# EAGLE design main (EAGLE 9.5.2)
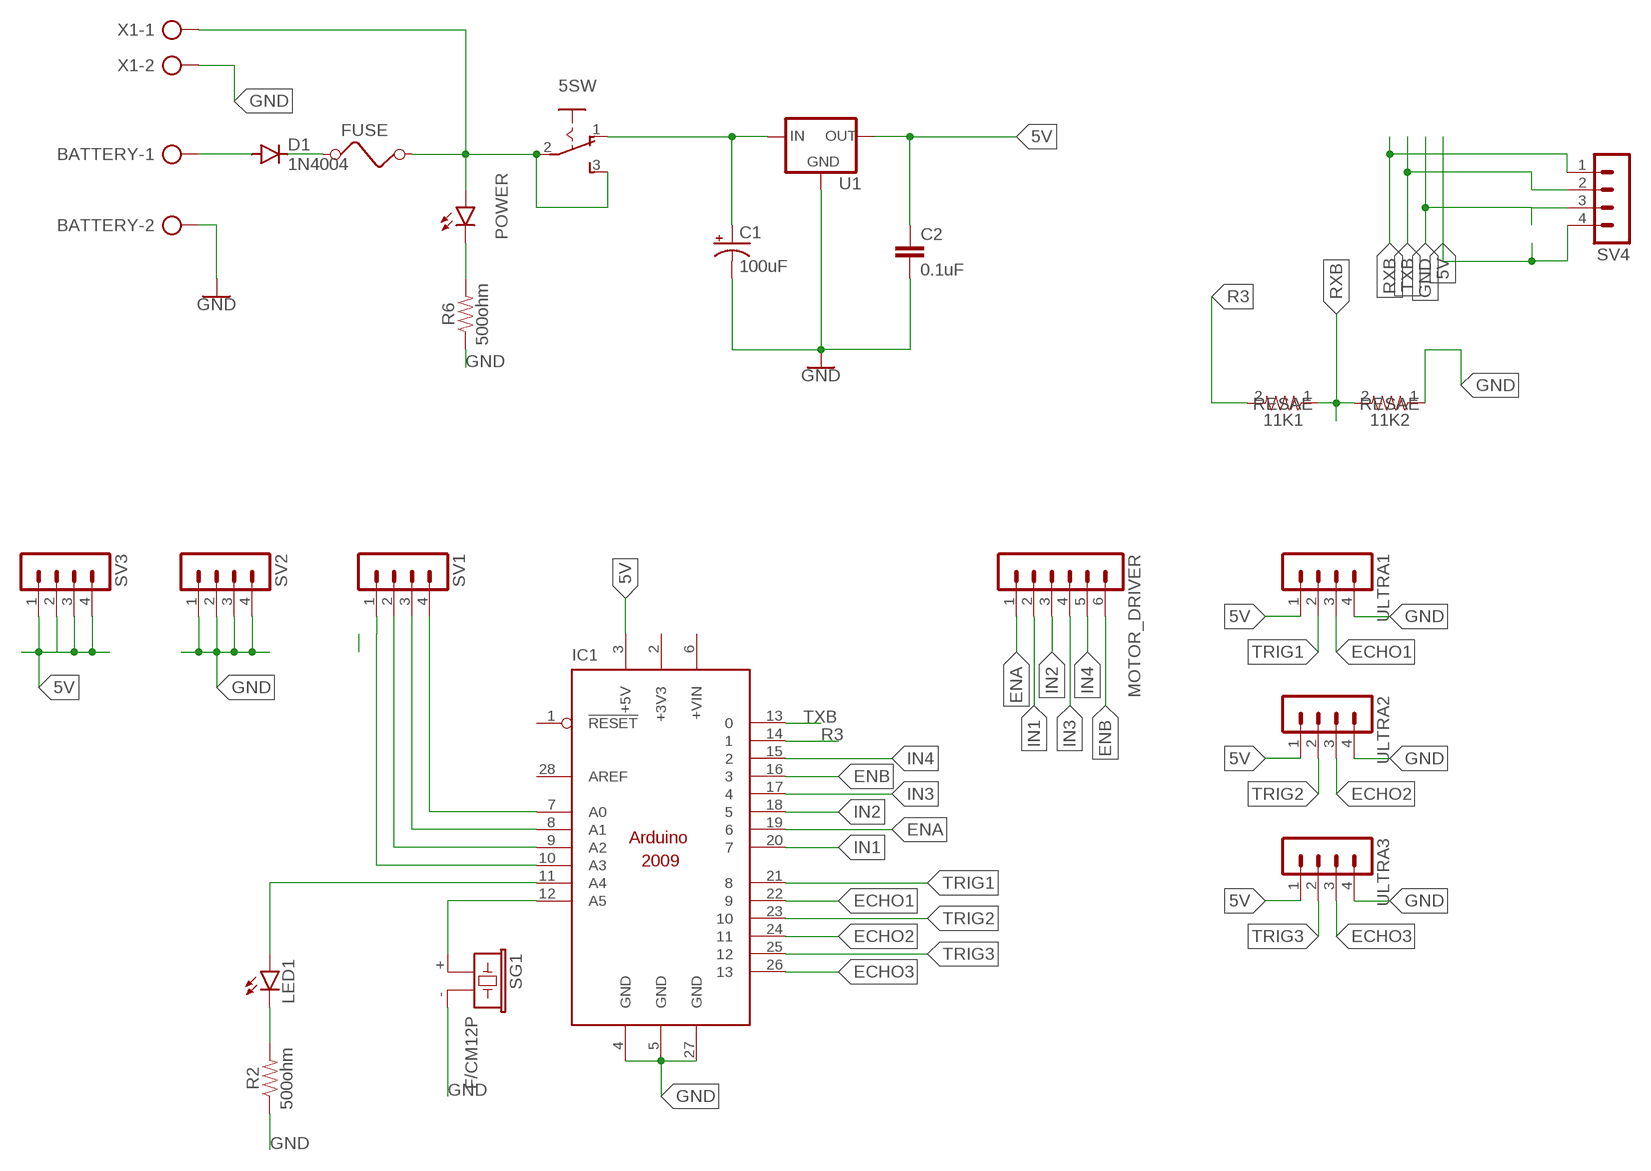
[diagram p0: schematic, sheet 1]

## Parts
5SW  255SB  [255SB]
11K1  RESAE  [RESAD846W63L520D250B]
11K2  RESAE  [RESAD846W63L520D250B]
BATTERY  AK500/2-H  [AK500/2-H]
C1  100uF  100UF-POLAR-RADIAL-2.5MM-25V-20%  [CPOL-RADIAL-2.5MM-6.5MM]
C2  0.1uF  0.1UF-KIT-EZ-50V-20%  [CAP-PTH-SMALL-KIT]
D1  1N4004  [DO41-10]
FUSE  FUSE  [FUSE]
IC1  ARDUINO2009_10  [ARDUINO2009]
LED1  LED10MM  [LED10MM]
MOTOR_DRIVER  MA06-1  [MA06-1]
POWER  LED3MM  [LED3MM]
R2  500ohm  10MOHM-HORIZ-1/4W-5%  [AXIAL-0.3]
R6  500ohm  10MOHM-HORIZ-1/4W-5%  [AXIAL-0.3]
SG1  F/CM12P  [F/CM12P]
SV1  MA04-1  [MA04-1]
SV2  MA04-1  [MA04-1]
SV3  MA04-1  [MA04-1]
SV4  MA04-1  [MA04-1]
U1  78XXS  [78XXS]
ULTRA1  MA04-1  [MA04-1]
ULTRA2  MA04-1  [MA04-1]
ULTRA3  MA04-1  [MA04-1]
X1  AK500/2-H  [AK500/2-H]

## Nets
5V: C2.1 IC1.3(+5V) SV3.1 SV3.2 SV3.3 SV3.4 SV4.4 U1.OUT ULTRA1.1 ULTRA2.1 ULTRA3.1
BATTERYI: BATTERY.1 D1.A
ECHO1: IC1.22 ULTRA1.3
ECHO2: IC1.24 ULTRA2.3
ECHO3: IC1.26 ULTRA3.3
ENA: IC1.19 MOTOR_DRIVER.1
ENB: IC1.16 MOTOR_DRIVER.6
GND: 11K2.1 BATTERY.2 C1.2(-) C2.2 IC1.4(GND) IC1.5(GND) IC1.27(GND) R2.P$1 R6.P$1 SG1.- SV2.1 SV2.2 SV2.3 SV2.4 SV4.3 U1.GND ULTRA1.4 ULTRA2.4 ULTRA3.4 X1.2
IN1: IC1.20 MOTOR_DRIVER.2
IN2: IC1.18 MOTOR_DRIVER.3
IN3: IC1.17 MOTOR_DRIVER.4
IN4: IC1.15 MOTOR_DRIVER.5
N$1: IC1.7(A0) SV1.4
N$2: IC1.8(A1) SV1.3
N$3: IC1.9(A2) SV1.2
N$4: IC1.10(A3) SV1.1
N$6: IC1.11(A4) LED1.A
N$9: D1.C FUSE.1
N$10: POWER.K(C) R6.P$2
N$11: 5SW.2(P) 5SW.3(S) FUSE.2 POWER.A X1.1
N$14: LED1.K(C) R2.P$2
N$15: IC1.12(A5) SG1.+
R3: 11K1.2 IC1.14
RXB: 11K1.1 11K2.2 SV4.1
SSS: 5SW.1(O) C1.1(+) U1.IN
TRIG1: IC1.21 ULTRA1.2
TRIG2: IC1.23 ULTRA2.2
TRIG3: IC1.25 ULTRA3.2
TXB: IC1.13 SV4.2
Unconnected: IC1.1(!RESET) IC1.6(+VIN) IC1.28(AREF)

## Power pins joined to a net without a drawn wire
+3V3: IC1.2(+3V3)

## Library data of the parts
5SW = switch:255SB: SLIDING SWITCH Distributor Buerklin, 11G810
11K1 11K2 = SparkFun-Resistors:RESAE
BATTERY X1 = con-ptr500:AK500/2-H: CONNECTOR Aug. 2004 / PTR Meßtechnik: Die Bezeichnung der Serie AK505 wurde geändert. Es handelt sich hierbei um AK500 in horizontaler Ausführung.; OC_FARNELL: unknown; OC_NEWARK: unknown
C1 = SparkFun-Capacitors:100UF-POLAR: 100µF polarized capacitors A capacitor is a passive two-terminal electrical component used to store electrical energy temporarily in an electric field.; PROD_ID: CAP-08439
C2 = SparkFun-Capacitors:0.1UF: 0.1µF ceramic capacitors A capacitor is a passive two-terminal electrical component used to store electrical energy temporarily in an electric field.; PROD_ID: CAP-08370
D1 = diode:1N4004: DIODE general purpose rectifier, 1 A
FUSE = special:FUSE: FUSE 5 x 20 mm
IC1 = arduino:ARDUINO2009_1: The Arduino Duemilanove ("2009") is a microcontroller board based on the ATmega168 or ATmega328. - 14 digital input/output pins (of which 6 can be used as PWM outputs) - 6 analog inputs, a 16 MHz crystal oscillator - USB connection - power jack - ISP header - reset button It contains everything needed to support the microcontroller; simply connect it to a computer with a USB cable or power it with a AC-to-DC adapter or battery to get started http://arduino.cc/en/Main/ArduinoBoardDuemilanove
LED1 POWER = led:LED: LED OSRAM: - CHIPLED LG R971, LG N971, LY N971, LG Q971, LY Q971, LO R971, LY R971 LH N974, LH R974 LS Q976, LO Q976, LY Q976 LO Q996 - Hyper CHIPLED LW Q18S LB Q993, LB Q99A, LB R99A - SideLED LS A670, LO A670, LY A670, LG A670, LP A670 LB A673, LV A673, LT A673, LW A673 LH A674 LY A675 LS A676, LA A676, LO A676, LY A676, LW A676 LS A679, LY A679, LG A679 - Hyper Micro SIDELED® LS Y876, LA Y876, LO Y876, LY Y876 LT Y87S - SmartLED LW L88C, LW L88S LB L89C, LB L89S, LG L890 LS L89K, LO L89K, LY L89K LS L896, LA L896, LO L896, LY L896 - TOPLED LS T670, LO T670, LY T670, LG T670, LP T670 LSG T670, LSP T670, LSY T670, LOP T670, LYG T670 LG T671, LOG T671, LSG T671 LB T673, LV T673, LT T673, LW T673 LH T674 LS T676, LA T676, LO T676, LY T676, LB T676, LH T676, LSB T676, LW T676 LB T67C, LV T67C, LT T67C, LS T67K, LO T67K, LY T67K, LW E67C LS E67B, LA E67B, LO E67B, LY E67B, LB E67C, LV E67C, LT E67C LW T67C LS T679, LY T679, LG T679 LS T770, LO T770, LY T770, LG T770, LP T770 LB T773, LV T773, LT T773, LW T773 LH T774 LS E675, LA E675, LY E675, LS T675 LS T776, LA T776, LO T776, LY T776, LB T776 LHGB T686 LT T68C, LB T68C - Hyper Mini TOPLED® LB M676 - Mini TOPLED Santana® LG M470 LS M47K, LO M47K, LY M47K Source: http://www.osram.convergy.de LUXEON: - LUMILED® LXK2-PW12-R00, LXK2-PW12-S00, LXK2-PW14-U00, LXK2-PW14-V00 LXK2-PM12-R00, LXK2-PM12-S00, LXK2-PM14-U00 LXK2-PE12-Q00, LXK2-PE12-R00, LXK2-PE12-S00, LXK2-PE14-T00, LXK2-PE14-U00 LXK2-PB12-K00, LXK2-PB12-L00, LXK2-PB12-M00, LXK2-PB14-N00, LXK2-PB14-P00, LXK2-PB14-Q00 LXK2-PR12-L00, LXK2-PR12-M00, LXK2-PR14-Q00, LXK2-PR14-R00 LXK2-PD12-Q00, LXK2-PD12-R00, LXK2-PD12-S00 LXK2-PH12-R00, LXK2-PH12-S00 LXK2-PL12-P00, LXK2-PL12-Q00, LXK2-PL12-R00 Source: www.luxeon.com KINGBRIGHT: KA-3528ASYC Source: www.kingbright.com
MOTOR_DRIVER = con-lstb:MA06-1: PIN HEADER; OC_FARNELL: unknown; OC_NEWARK: unknown
R2 R6 = SparkFun-Resistors:10MOHM: RES-09327; PROD_ID: RES-09327; VALUE: 10M
SG1 = buzzer:F/CM12P: BUZZER Source: Buerklin; OC_FARNELL: unknown; OC_NEWARK: unknown
SV1-SV4 ULTRA1-ULTRA3 = con-lstb:MA04-1: PIN HEADER; OC_FARNELL: unknown; OC_NEWARK: unknown
U1 = v-reg:78XXS: VOLTAGE REGULATOR

## Board
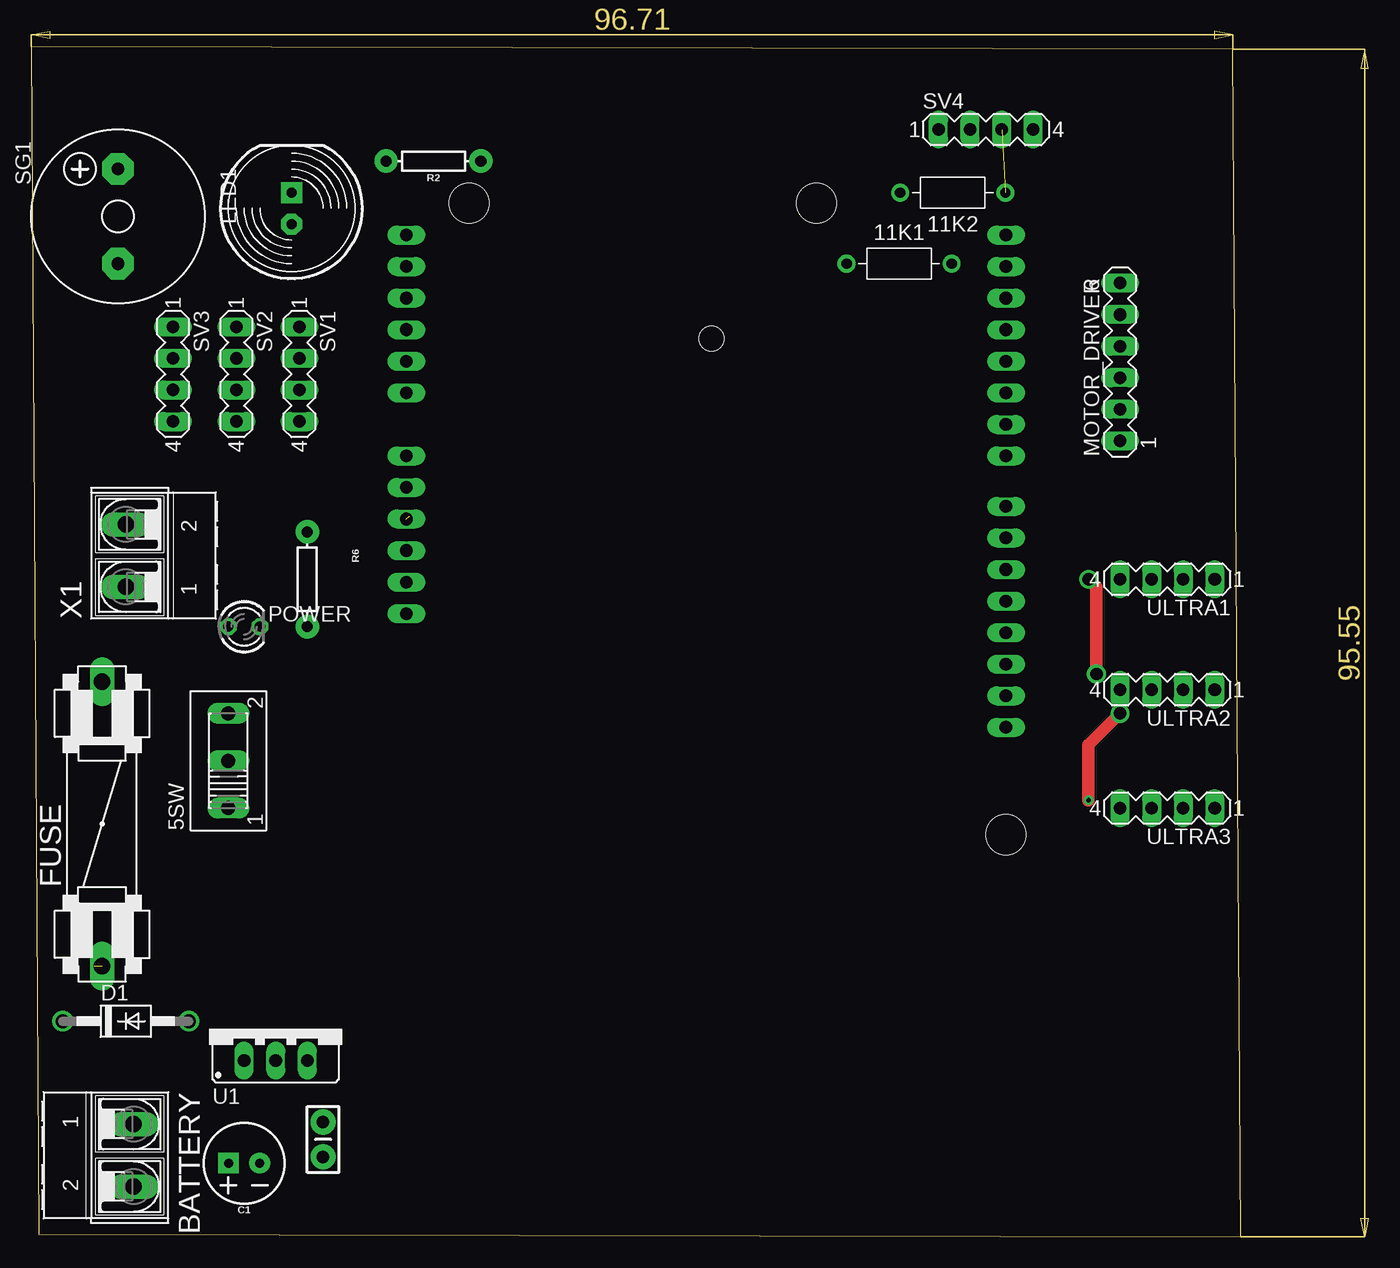
[diagram p1: board, top side]
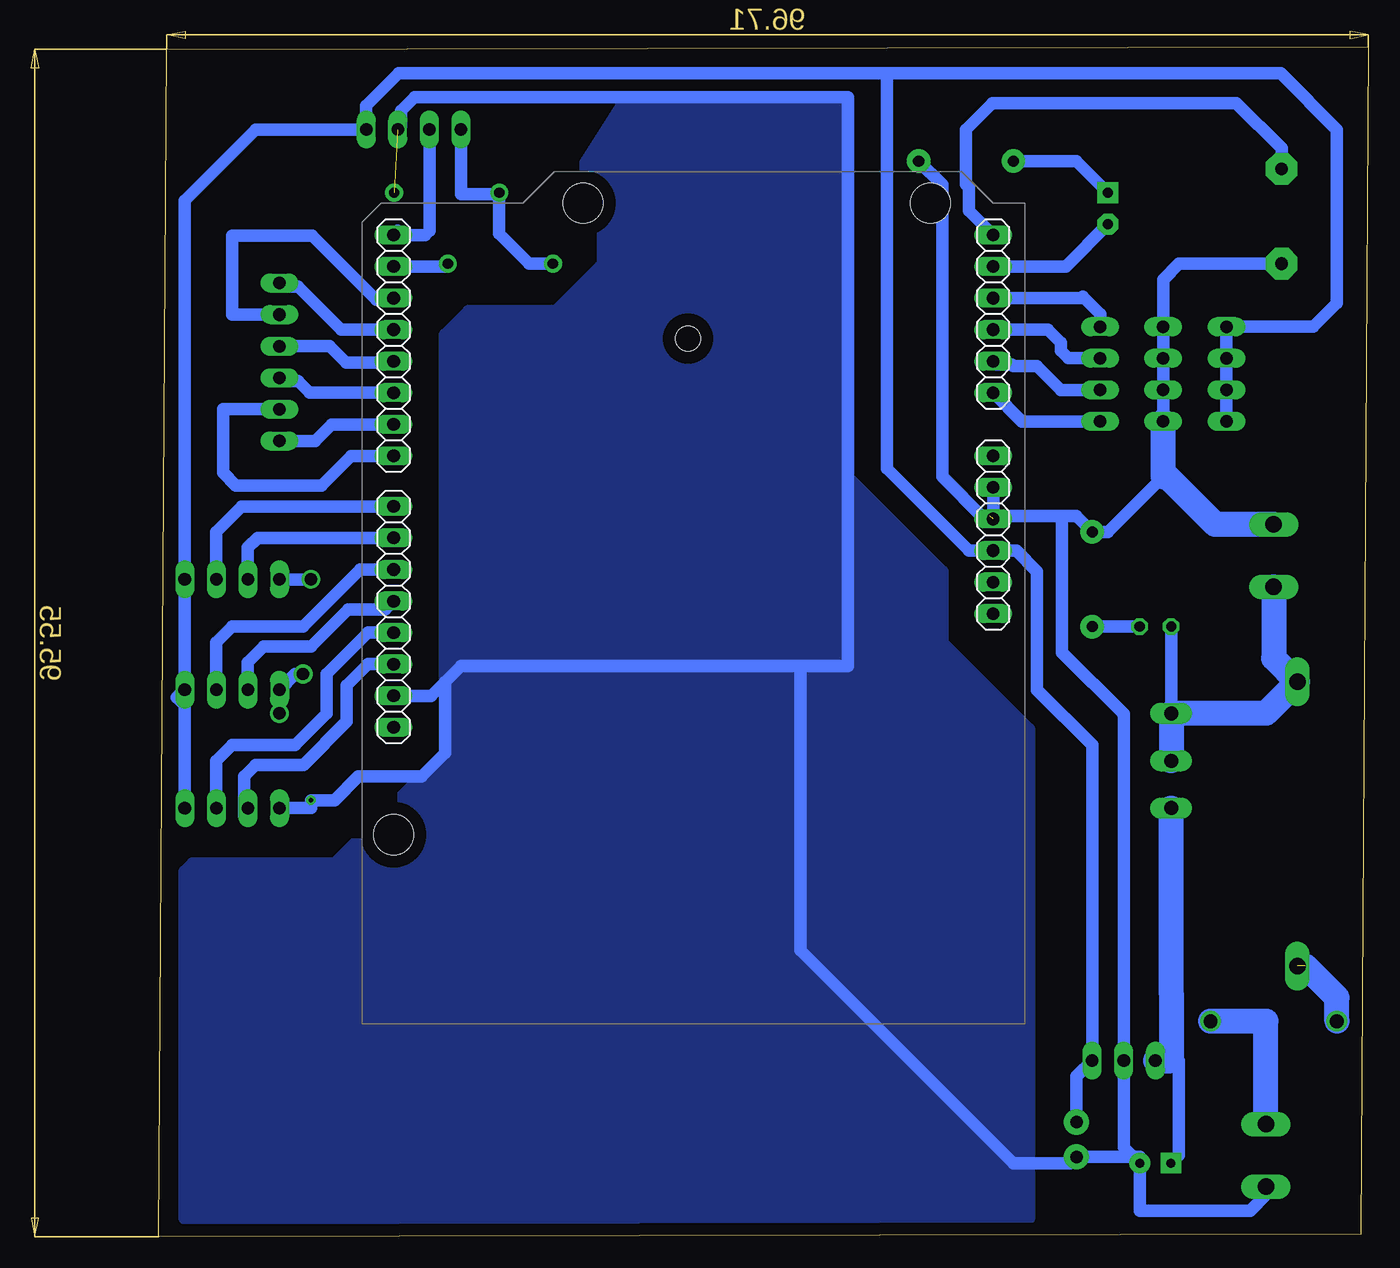
[diagram p2: board, bottom side, seen from below]

Size 97.34 x 95.77 mm. Coordinates in mm from the lower left corner, seen from the top.
Outline: 0.64,0.21 97.34,0 96.71,95.55 0,95.77 0.64,0.21
Copper layers (1*16): Top 0.035mm / dielectric 1.5mm / Bottom 0.035mm
Design rules "default *": minimum track width 1mm, minimum drill 0.35mm, track to track 0.6mm, track to pad 0.8mm, pad to pad 6mil, via to via 6mil, smd to smd 6mil, copper to edge 40mil, drill to drill 6mil, minimum pad ring 10mil, minimum via ring 8mil, stop-mask expansion 4mil, vias tented up to drill 0mil, thermal gap 10mil

### Footprints (pad centres in the part's own frame; a part is rotated, then mirrored left to right if it is on the bottom)
255SB = drill 1.118 long: 1 -3.81,0; 2 0,0; 3 3.81,0
RESAD846W63L520D250B = drill 0.83 pad 1.43: 1 -4.23,0; 2 4.23,0
AK500/2-H = drill 1.321 long: 1 -2.515,0; 2 2.515,0
CPOL-RADIAL-2.5MM-6.5MM = drill 0.7 pad 1.651 square: 1 1.25,0 | drill 0.7 pad 1.651: 2 -1.25,0
CAP-PTH-SMALL-KIT = drill 1.016 pad 2.032: 1 -1.397,0; 2 1.397,0
DO41-10 = drill 1.118: A 5.08,0; C -5.08,0
FUSE = drill 1.321 long: 1 -11.43,0; 2 11.43,0
ARDUINO2009 = drill 1.016 long: 1 33.02,2.54; 2 35.56,2.54; 3 38.1,2.54; 4 40.64,2.54; 5 43.18,2.54; 6 45.72,2.54; 7 50.8,2.54; 8 53.34,2.54; 9 55.88,2.54; 10 58.42,2.54; 11 60.96,2.54; 12 63.5,2.54; 13 63.5,50.8; 14 60.96,50.8; 15 58.42,50.8; 16 55.88,50.8; 17 53.34,50.8; 18 50.8,50.8; 19 48.26,50.8; 20 45.72,50.8; 21 41.656,50.8; 22 39.116,50.8; 23 36.576,50.8; 24 34.036,50.8; 25 31.496,50.8; 26 28.956,50.8; 27 26.416,50.8; 28 23.876,50.8 | hole 3.2: 15.24,50.8; 66.04,35.56; 66.04,7.62 | hole 2: 55.17,27.114
LED10MM = drill 0.813 pad 1.676 octagon: A -1.27,0 | drill 0.813 pad 1.676 square: K 1.27,0
MA06-1 = drill 1.016 long: 1 -6.35,0; 2 -3.81,0; 3 -1.27,0; 4 1.27,0; 5 3.81,0; 6 6.35,0
LED3MM = drill 0.813 octagon: A -1.27,0; K 1.27,0
AXIAL-0.3 = drill 0.9 pad 1.88: P$1 -3.81,0; P$2 3.81,0
F/CM12P = drill 1.016 pad 2.54 octagon: + 3.81,0; - -3.81,0
MA04-1 = drill 1.016 long: 1 -3.81,0; 2 -1.27,0; 3 1.27,0; 4 3.81,0
78XXS = drill 1.016 long: GND 0,-2.54; IN -2.54,-2.54; OUT 2.54,-2.54

### Placement (x,y rotation side)
5SW  15.88,38.31 90 top
11K1  69.85,78.31 0 top
11K2  74.17,84.03 180 top
BATTERY  8.25,6.56 270 top
C1  17.14,5.92 180 top
C2  23.5,7.83 270 top
D1  7.62,17.36 0 top
FUSE  5.71,33.23 90 top
IC1  27.65,17.12 90 bottom
LED1  20.96,82.76 90 top
MOTOR_DRIVER  87.63,70.4 90 top
POWER  17.14,49.11 0 top
R2  32.39,86.57 180 top
R6  22.22,52.91 270 top
SG1  6.98,82.12 90 top
SV1  21.59,69.42 270 top
SV2  16.51,69.42 270 top
SV3  11.43,69.42 270 top
SV4  76.84,89.11 0 top
U1  19.68,16.72 0 top
ULTRA1  91.44,52.91 180 top
ULTRA2  91.44,44.03 180 top
ULTRA3  91.44,34.5 180 top
X1  7.62,54.82 90 top

### Tracks (layer width: path | path; a pad name or v marks a point on that pad's centre or on a via)
5V
  Bottom 1: ULTRA3.1 95.25,42.76 95.89,43.39 ULTRA2.1 ULTRA1.1 95.25,83.39 89.54,89.11 SV4.4 80.65,91.02 78.02,93.64 38.73,93.64 | SV3.4 SV3.3 SV3.2 SV3.1 4.45,73.23 2.54,75.14 2.54,89.11 7.07,93.64 38.73,93.64 | C2.1 23.5,12.91 U1.OUT 22.22,39.58 26.67,44.03 26.67,53.55 28.34,55.22 IC1.3 32.15,55.22 38.73,61.8 38.73,93.64 | 38.73,93.64
BATTERYI
  Bottom 2: BATTERY.1 8.25,17.36 D1.A
ECHO1
  Bottom 1: IC1.22 89.39,56.24 90.17,55.46 ULTRA1.3
ECHO2
  Bottom 1: IC1.24 79.13,50.47 82.09,50.47 85.06,47.51 88.9,47.51 90.17,46.23 ULTRA2.3
ECHO3
  Bottom 1: IC1.26 80.5,46.08 82.22,44.36 82.22,41.46 85.7,37.98 89.54,37.98 90.45,37.06 90.45,33.87 90.17,34.15 ULTRA3.3
ENA
  Bottom 1: MOTOR_DRIVER.1 84.75,64.05 83.42,65.38 IC1.19
ENB
  Bottom 1: MOTOR_DRIVER.6 87.35,76.47 86.13,76.47 82.67,73 IC1.16
GND  (via drill 0.35, 1)  (2 unrouted)
  Top 1: v85.09,35.14 85.09,39.58 v87.63,42.12 | v85.73,45.3 85.73,52.28 v85.09,52.91
  Bottom 1: ULTRA3.4 85.09,34.5 v85.09,35.14 83.19,35.14 81.28,37.04 76.2,37.04 74.3,38.95 74.3,44.66 | v87.63,42.12 ULTRA2.4 86.36,45.3 v85.73,45.3 | v85.09,52.91 ULTRA1.4 | SV2.4 SV2.3 SV2.2 SV2.1 16.51,77.05 15.24,78.31 SG1.- | 16.51,61.17 20.96,56.73 R6.P$1 23.5,58 24.66,58 | 24.66,58 30.48,58 | IC1.5 IC1.4 30.88,57.76 34.29,61.17 34.29,84.66 R2.P$1 | C1.2 19.67,7.19 19.67,14.18 U1.GND 19.68,42.06 24.66,47.04 24.66,58 | C1.2 18.39,6.43 C2.2 24,5.92 28.57,5.92 45.72,23.07 45.72,45.93 | C1.2 18.39,2.12 9.53,2.12 8.25,3.39 BATTERY.2 | SV4.3 77.82,89.39 77.82,90.61 76.73,91.7 41.86,91.7 41.86,45.93 45.72,45.93 | 45.72,45.93 73.03,45.93 74.3,44.66 | IC1.27 75.42,43.54 74.3,44.66
  Bottom 2: X1.2 12.33,57.34 16.51,61.51 | 16.51,61.17 16.51,61.51 | 16.51,61.51 SV2.4
  pour Bottom: 41.91,90.89 41.91,61.17 34.29,53.55 34.29,47.84 27.31,40.85 27.31,1.48 95.25,1.48 95.25,29.42 94.62,30.05 83.19,30.05 74.3,38.95 74.3,72.6 72.39,74.5 65.41,74.5 61.59,78.31 61.59,82.12 64.14,84.66 59.77,91.52
IN1
  Bottom 1: IC1.20 81.87,62.84 84.25,60.46 91.15,60.46 92.17,61.48 92.17,66.59 MOTOR_DRIVER.2
IN2
  Bottom 1: MOTOR_DRIVER.3 87.35,68.85 86.13,68.85 85.21,67.92 IC1.18
IN3
  Bottom 1: IC1.17 78.57,70.34 82.27,70.34 83.6,71.67 MOTOR_DRIVER.4
IN4
  Bottom 1: IC1.15 78.57,75.42 79.84,75.42 85,80.58 91.44,80.58 91.44,74.21 MOTOR_DRIVER.5
N$1
  Bottom 1: IC1.7 27.88,65.61 SV1.4
N$2
  Bottom 1: IC1.8 29.9,70.18 28.69,70.18 28.57,70.06 26.67,70.06 24.77,68.16 SV1.3
N$3
  Bottom 1: IC1.9 25.8,73 24.77,71.96 24.77,71.33 24.13,70.69 SV1.2
N$4
  Bottom 1: IC1.10 23.09,75.54 22.98,75.65 21.59,74.26 SV1.1
N$6
  Bottom 1: IC1.11 24.36,78.08 LED1.A
N$9  (1 unrouted)
  Bottom 2: 5.08,21.8 2.54,19.26 D1.C
N$10
  Bottom 1: R6.P$2 POWER.K
N$11
  Bottom 1: POWER.A 5SW.3
  Bottom 2: 5SW.2 5SW.3 8.25,42.12 FUSE.2 7.62,46.57 X1.1
N$14
  Bottom 1: LED1.K 23.5,86.57 R2.P$2
N$15
  Bottom 1: IC1.12 32.15,82.59 32.15,84.45 32.39,84.69 32.39,89.11 30.26,91.23 10.64,91.23 6.99,87.59 SG1.+
R3
  Bottom 1: 11K1.2 74.31,78.08 IC1.14
RXB
  Bottom 1: 11K1.1 67.53,78.31 69.94,80.73 11K2.2 70.05,83.91 73.03,83.91 SV4.1
SSS
  Bottom 1: U1.IN 15.24,14.18 15.24,6.58 C1.1
  Bottom 2: 15.88,19.65 15.88,14.18 U1.IN | 15.88,19.65 | 15.88,19.65 5SW.1
TRIG1
  Bottom 1: IC1.21 90.66,58.78 92.71,56.73 ULTRA1.2
TRIG2
  Bottom 1: IC1.23 81.13,53.7 85.73,49.11 91.44,49.11 92.71,47.84 ULTRA2.2
TRIG3
  Bottom 1: IC1.25 80.5,48.62 83.82,45.3 83.82,42.12 86.36,39.58 91.44,39.58 92.71,38.31 ULTRA3.2
TXB
  Bottom 1: 78.11,80.96 IC1.13 75.91,80.62 75.56,80.96 SV4.2